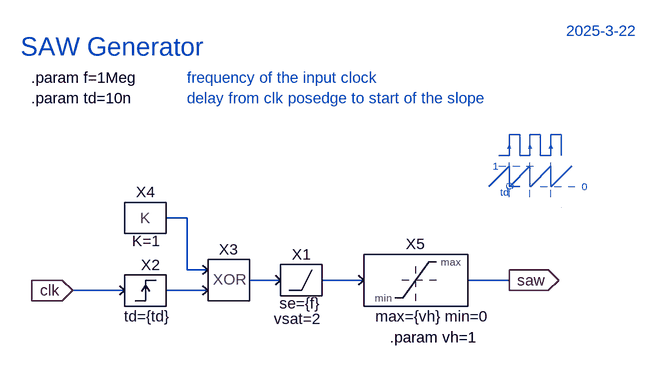
[diagram p0: schematic SAW.asc]
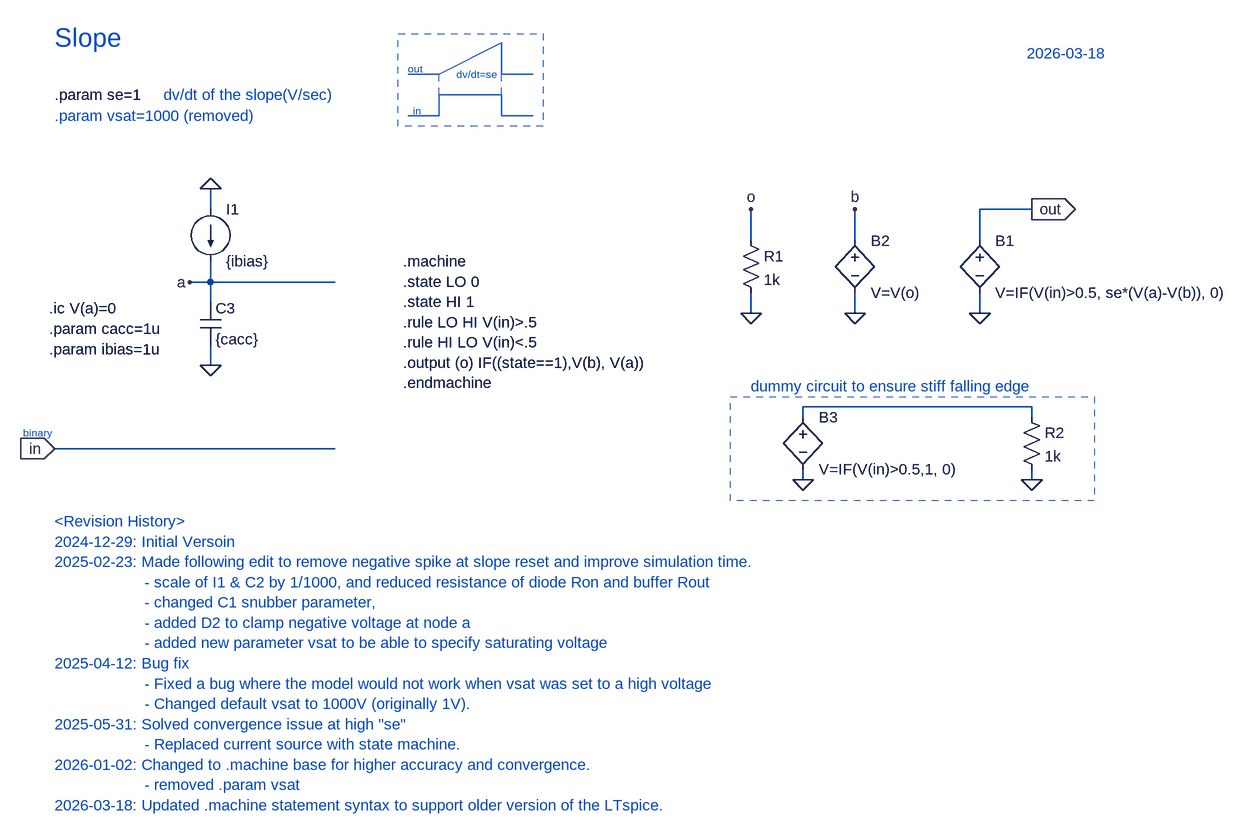
[diagram p1: sub-circuit slope.asc]
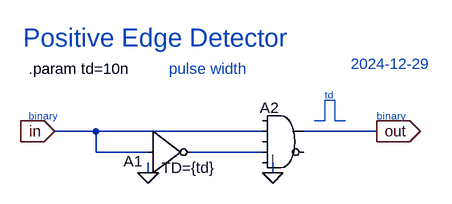
[diagram p2: sub-circuit posedge.asc]
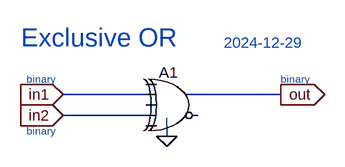
[diagram p3: sub-circuit exor.asc]
SAW.asc, the LTspice schematic file:
Version 4
SHEET 1 1624 680
WIRE 0 -144 -32 -144
WIRE 0 -64 0 -144
WIRE 32 -64 0 -64
WIRE 144 -48 96 -48
WIRE 272 -48 208 -48
WIRE 496 -48 432 -48
WIRE -96 -32 -176 -32
WIRE 32 -32 -32 -32
FLAG -176 -32 clk
IOPIN -176 -32 In
FLAG 496 -48 saw
IOPIN 496 -48 Out
SYMBOL PowerSim\\SLOPE 176 -48 R0
WINDOW 39 -2 51 Bottom 2
WINDOW 40 -6 75 Bottom 2
SYMATTR SpiceLine se={f}
SYMATTR SpiceLine2 vsat=2
SYMATTR InstName X1
SYMBOL PowerSim\\POSEDGE -64 -32 R0
WINDOW 39 3 55 Bottom 2
SYMATTR SpiceLine td={td}
SYMATTR InstName X2
SYMBOL PowerSim\\EXOR 64 -48 R0
SYMATTR InstName X3
SYMBOL PowerSim\\CONST -64 -144 R0
WINDOW 39 1 51 Bottom 2
SYMATTR InstName X4
SYMBOL PowerSim\\LIMIT 352 -48 R0
WINDOW 39 26 71 Bottom 2
SYMATTR SpiceLine max={vh} min=0
SYMATTR InstName X5
TEXT -256 -408 Left 4 ;SAW Generator
TEXT 584 -432 Left 2 ;2025-3-22
TEXT -240 -360 Left 2 !.param f=1Meg\n.param td=10n
TEXT 0 -360 Left 2 ;frequency of the input clock\ndelay from clk posedge to start of the slope
TEXT 480 -224 Right 1 ;1
TEXT 608 -192 Left 1 ;0
TEXT 312 40 Left 2 !.param vh=1
TEXT 496 -184 Right 1 ;td
LINE Normal 528 -224 497 -192
LINE Normal 496 -176 496 -240 2
LINE Normal 576 -160 576 -160 2
LINE Normal 496 -240 480 -240
LINE Normal 496 -240 496 -272
LINE Normal 512 -272 496 -272
LINE Normal 512 -240 512 -272
LINE Normal 528 -240 512 -240
LINE Normal 528 -240 528 -272
LINE Normal 544 -272 528 -272
LINE Normal 544 -240 544 -272
LINE Normal 560 -240 544 -240
LINE Normal 560 -240 560 -272
LINE Normal 576 -272 560 -272
LINE Normal 576 -240 576 -272
LINE Normal 528 -176 528 -240 2
LINE Normal 560 -176 560 -240 2
LINE Normal 560 -224 529 -192
LINE Normal 496 -192 496 -224
LINE Normal 496 -224 465 -192
LINE Normal 497 -192 496 -192
LINE Normal 528 -192 528 -224
LINE Normal 529 -192 528 -192
LINE Normal 592 -224 561 -192
LINE Normal 560 -192 560 -224
LINE Normal 561 -192 560 -192
LINE Normal 480 -224 544 -224 2
LINE Normal 544 -192 608 -192 2
LINE Normal 494 -251 496 -256
LINE Normal 498 -251 496 -256
LINE Normal 526 -251 528 -256
LINE Normal 530 -251 528 -256
LINE Normal 558 -251 560 -256
LINE Normal 562 -251 560 -256
CIRCLE Normal 512 -192 496 -192 2
CIRCLE Normal 492 -198 502 -188 2

slope.asc, the sub-circuit schematic file:
Version 4.1
SHEET 1 2080 1228
WIRE -64 288 -64 256
WIRE 1200 288 1120 288
WIRE 768 336 768 288
WIRE 928 336 928 288
WIRE 1120 336 1120 288
WIRE -64 400 -64 368
WIRE -64 400 -96 400
WIRE 128 400 -64 400
WIRE -64 432 -64 400
WIRE 768 448 768 416
WIRE 928 448 928 416
WIRE 1120 448 1120 416
WIRE -64 528 -64 496
WIRE 1200 592 848 592
WIRE 848 608 848 592
WIRE 1200 608 1200 592
WIRE 128 656 -304 656
WIRE 848 704 848 688
WIRE 1200 704 1200 688
FLAG -304 656 in
IOPIN -304 656 In
FLAG -64 256 0
FLAG -64 528 0
FLAG 1200 288 out
IOPIN 1200 288 Out
FLAG -96 400 a
FLAG 1120 448 0
FLAG 768 448 0
FLAG 768 288 o
FLAG 928 448 0
FLAG 928 288 b
FLAG 1200 704 0
FLAG 848 704 0
SYMBOL current -64 288 R0
SYMATTR InstName I1
SYMATTR Value {ibias}
SYMBOL cap -80 432 R0
SYMATTR InstName C3
SYMATTR Value {cacc}
SYMBOL bv 1120 320 R0
SYMATTR InstName B1
SYMATTR Value V=IF(V(in)>0.5, se*(V(a)-V(b)), 0)
SYMBOL res 752 320 R0
SYMATTR InstName R1
SYMATTR Value 1k
SYMBOL bv 928 320 R0
SYMATTR InstName B2
SYMATTR Value V=V(o)
SYMBOL bv 848 592 R0
SYMATTR InstName B3
SYMATTR Value V=IF(V(in)>0.5,1, 0)
SYMBOL res 1184 592 R0
SYMATTR InstName R2
SYMATTR Value 1k
TEXT -304 112 Left 2 !.param se=1
TEXT -304 24 Left 4 ;Slope
TEXT -352 632 Left 1 ;binary
TEXT -136 112 Left 2 ;dv/dt of the slope(V/sec)
TEXT 248 136 Left 1 ;in
TEXT 240 72 Left 1 ;out
TEXT 376 80 Right 1 ;dv/dt=se
TEXT 1192 48 Left 2 ;2026-03-18
TEXT -304 768 Left 2 ;<Revision History>\n2024-12-29: Initial Versoin\n2025-02-23: Made following edit to remove negative spike at slope reset and improve simulation time.\n                    - scale of I1 & C2 by 1/1000, and reduced resistance of diode Ron and buffer Rout\n                    - changed C1 snubber parameter, \n                    - added D2 to clamp negative voltage at node a \n                    - added new parameter vsat to be able to specify saturating voltage\n2025-04-12: Bug fix \n                    - Fixed a bug where the model would not work when vsat was set to a high voltage \n                    - Changed default vsat to 1000V (originally 1V).\n2025-05-31: Solved convergence issue at high "se" \n                    - Replaced current source with state machine.\n2026-01-02: Changed to .machine base for higher accuracy and convergence.\n                    - removed .param vsat\n2026-03-18: Updated .machine statement syntax to support older version of the LTspice.
TEXT -304 144 Left 2 ;.param vsat=1000 (removed)
TEXT -312 472 Left 2 !.param cacc=1u\n.param ibias=1u
TEXT -312 440 Left 2 !.ic V(a)=0
TEXT 232 368 Left 2 !.machine\n.state LO 0\n.state HI 1\n.rule LO HI V(in)>.5\n.rule HI LO V(in)<.5\n.output (o) IF((state==1),V(b), V(a))\n.endmachine
TEXT 768 560 Left 2 ;dummy circuit to ensure stiff falling edge
LINE Normal 288 144 240 144
LINE Normal 288 144 288 112
LINE Normal 384 112 288 112
LINE Normal 384 144 384 112
LINE Normal 432 144 384 144
LINE Normal 288 80 240 80
LINE Normal 288 80 384 32
LINE Normal 384 80 384 32
LINE Normal 432 80 384 80
LINE Normal 288 112 288 80 1
LINE Normal 384 112 384 80 1
RECTANGLE Normal 448 160 225 18 2
RECTANGLE Normal 1296 736 736 576 2

posedge.asc, the sub-circuit schematic file:
Version 4
SHEET 1 880 680
WIRE 192 160 128 160
WIRE 448 160 192 160
WIRE 624 160 512 160
WIRE 192 192 192 160
WIRE 272 192 192 192
WIRE 448 192 336 192
WIRE 272 224 272 208
WIRE 464 224 464 208
FLAG 128 160 in
IOPIN 128 160 In
FLAG 464 224 0
FLAG 624 160 out
IOPIN 624 160 Out
FLAG 272 224 0
SYMBOL Digital\\and 480 112 R0
WINDOW 0 -36 12 Left 2
SYMATTR InstName A2
SYMBOL Digital\\inv 272 128 R0
WINDOW 3 21 88 Left 2
WINDOW 0 -38 78 Left 2
SYMATTR Value TD={td}
SYMATTR InstName A1
TEXT 88 64 Left 2 !.param td=10n
TEXT 80 16 Left 4 ;Positive Edge Detector
TEXT 88 136 Left 1 ;binary
TEXT 624 136 Left 1 ;binary
TEXT 544 104 Left 1 ;td
TEXT 304 64 Left 2 ;pulse width
TEXT 584 56 Left 2 ;2024-12-29
LINE Normal 544 144 528 144
LINE Normal 544 144 544 112
LINE Normal 560 144 560 112
LINE Normal 576 144 560 144
LINE Normal 544 112 560 112

exor.asc, the sub-circuit schematic file:
Version 4
SHEET 1 880 680
WIRE 160 128 32 128
WIRE 368 128 224 128
WIRE 160 160 32 160
WIRE 192 192 192 176
FLAG 192 192 0
FLAG 32 128 in1
IOPIN 32 128 In
FLAG 32 160 in2
IOPIN 32 160 In
FLAG 368 128 out
IOPIN 368 128 Out
SYMBOL Digital\\xor 208 80 R0
WINDOW 0 -28 14 Left 2
SYMATTR InstName A1
TEXT -24 104 Left 1 ;binary
TEXT -24 184 Left 1 ;binary
TEXT 368 104 Left 1 ;binary
TEXT -32 40 Left 4 ;Exclusive OR
TEXT 280 48 Left 2 ;2024-12-29

The netlist it stands for:
* SAW.asc
XX1 N002 N003 slope params: se={f} vsat=2
XX2 clk N004 posedge params: td={td}
XX3 N001 N004 N002 exor
XX4 N001 CONST K=1  ; pins K
XX5 N003 saw LIMIT max={vh} min=0  ; pins in out

* block symbol definitions
.subckt slope in out
I1 0 a {ibias}
C3 a 0 {cacc}
B1 out 0 V=IF(V(in)>0.5, se*(V(a)-V(b)), 0)
R1 o 0 1k
B2 b 0 V=V(o)
B3 N001 0 V=IF(V(in)>0.5,1, 0)
R2 N001 0 1k
.param se=1
* Slope
* binary
* dv/dt of the slope(V/sec)
* in
* out
* dv/dt=se
* 2026-03-18
* <Revision History>
* 2024-12-29: Initial Versoin
* 2025-02-23: Made following edit to remove negative spike at slope reset and improve simulation time.
*                     - scale of I1 & C2 by 1/1000, and reduced resistance of diode Ron and buffer Rout
*                     - changed C1 snubber parameter,
*                     - added D2 to clamp negative voltage at node a
*                     - added new parameter vsat to be able to specify saturating voltage
* 2025-04-12: Bug fix
*                     - Fixed a bug where the model would not work when vsat was set to a high voltage
*                     - Changed default vsat to 1000V (originally 1V).
* 2025-05-31: Solved convergence issue at high "se"
*                     - Replaced current source with state machine.
* 2026-01-02: Changed to .machine base for higher accuracy and convergence.
*                     - removed .param vsat
* 2026-03-18: Updated .machine statement syntax to support older version of the LTspice.
* .param vsat=1000 (removed)
.param cacc=1u
.param ibias=1u
.ic V(a)=0
.machine
.state LO 0
.state HI 1
.rule LO HI V(in)>.5
.rule HI LO V(in)<.5
.output (o) IF((state==1),V(b), V(a))
.endmachine
* dummy circuit to ensure stiff falling edge
.ends slope

.subckt posedge in out
A2 0 in 0 N001 0 0 out 0 AND
A1 in 0 0 0 0 N001 0 0 BUF TD={td}
.param td=10n
* Positive Edge Detector
* binary
* binary
* td
* pulse width
* 2024-12-29
.ends posedge

.subckt exor in1 in2 out
A1 0 in1 0 in2 0 0 out 0 XOR
* binary
* binary
* binary
* Exclusive OR
* 2024-12-29
.ends exor

* SAW Generator
* 2025-3-22
.param f=1Meg
.param td=10n
* frequency of the input clock
* delay from clk posedge to start of the slope
* 1
* 0
.param vh=1
* td
.backanno
.end